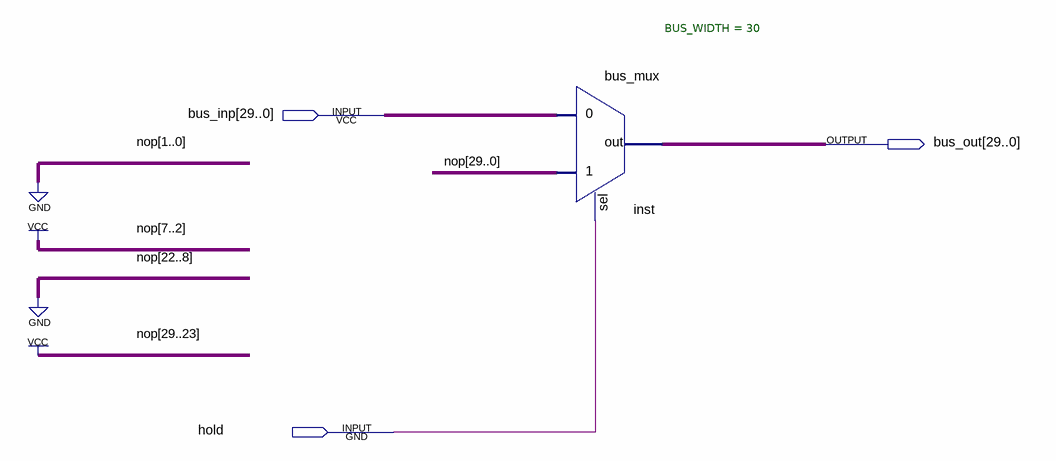
[diagram p0: schematic sheet]
// Quartus schematic uc_1.bdf as structural Verilog: 1 symbols, 3 pins
module uc_1 (
  input  [29:0] bus_inp,
  input  hold,
  output [29:0] bus_out
);

  bus_mux #(.BUS_WIDTH(30)) inst (.in0(bus_inp), .in1(30'b111111100000000000000011111100), .sel(hold), .out(bus_out));
endmodule
